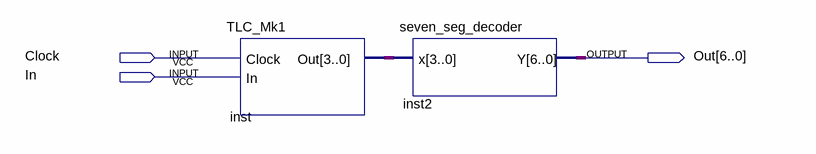
[diagram p0: schematic sheet]
// Quartus schematic TLC_Mk1_Test.bdf as structural Verilog: 2 symbols, 3 pins
module TLC_Mk1_Test (
  input  Clock,
  input  In,
  output [6:0] Out
);

  wire [3:0] inst_out;

  TLC_Mk1 inst (.Clock(Clock), .In(In), .Out(inst_out));
  seven_seg_decoder inst2 (.x(inst_out), .Y(Out));
endmodule
